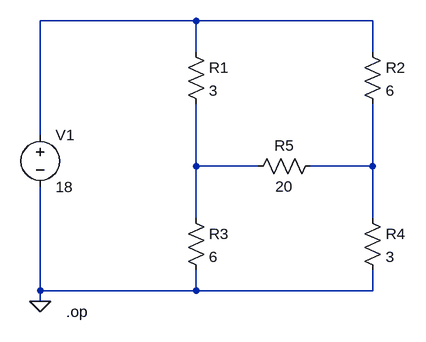
[diagram p0: schematic CH03-KP4-05.asc]
CH03-KP4-05.asc, the LTspice schematic file:
Version 4
SHEET 1 880 680
WIRE 160 176 -80 176
WIRE 432 176 160 176
WIRE 160 224 160 176
WIRE 432 224 432 176
WIRE -80 352 -80 176
WIRE 160 400 160 304
WIRE 256 400 160 400
WIRE 432 400 432 304
WIRE 432 400 336 400
WIRE 160 480 160 400
WIRE 432 480 432 400
WIRE -80 592 -80 432
WIRE 160 592 160 560
WIRE 160 592 -80 592
WIRE 432 592 432 560
WIRE 432 592 160 592
WIRE -80 608 -80 592
FLAG -80 608 0
SYMBOL res 144 208 R0
SYMATTR InstName R1
SYMATTR Value 3
SYMBOL res 416 208 R0
SYMATTR InstName R2
SYMATTR Value 6
SYMBOL res 144 464 R0
SYMATTR InstName R3
SYMATTR Value 6
SYMBOL res 416 464 R0
SYMATTR InstName R4
SYMATTR Value 3
SYMBOL res 240 416 R270
WINDOW 0 32 56 VTop 2
WINDOW 3 0 56 VBottom 2
SYMATTR InstName R5
SYMATTR Value 20
SYMBOL voltage -80 336 R0
SYMATTR InstName V1
SYMATTR Value 18
TEXT -40 624 Left 2 !.op

The netlist it stands for:
* CH03-KP4-05.asc
R1 N001 N002 3
R2 N001 N003 6
R3 N002 0 6
R4 N003 0 3
R5 N002 N003 20
V1 N001 0 18
.op
.backanno
.end